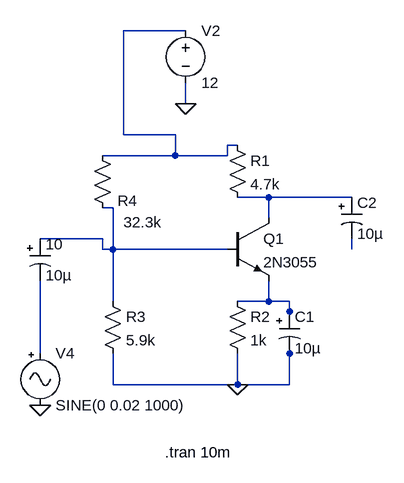
[diagram p0: schematic exp3(single stage amplifier using 3055A.asc]
exp3(single stage amplifier using 3055A.asc, the LTspice schematic file:
Version 4
SHEET 1 1288 680
WIRE 304 -128 208 -128
WIRE 304 -16 304 -48
WIRE 208 32 208 -128
WIRE 288 32 208 32
WIRE 384 48 368 48
WIRE 288 64 288 32
WIRE 288 64 176 64
WIRE 368 64 368 48
WIRE 368 64 288 64
WIRE 432 128 384 128
WIRE 560 128 432 128
WIRE 192 144 176 144
WIRE 432 160 432 128
WIRE 176 192 80 192
WIRE 176 208 176 192
WIRE 192 208 192 144
WIRE 192 208 176 208
WIRE 368 208 192 208
WIRE 560 208 560 192
WIRE 192 288 192 208
WIRE 432 288 432 256
WIRE 432 288 384 288
WIRE 464 288 432 288
WIRE 464 304 464 288
WIRE 464 320 464 304
WIRE 80 368 80 256
WIRE 464 368 464 352
WIRE 192 416 192 368
WIRE 384 416 384 368
WIRE 384 416 192 416
WIRE 464 416 464 368
WIRE 464 416 384 416
FLAG 384 416 0
FLAG 304 -16 0
FLAG 80 448 0
SYMBOL npn 368 160 R0
SYMATTR InstName Q1
SYMATTR Value 2N3055
SYMBOL res 368 32 R0
SYMATTR InstName R1
SYMATTR Value 4.7k
SYMBOL res 368 272 R0
SYMATTR InstName R2
SYMATTR Value 1k
SYMBOL res 176 272 R0
SYMATTR InstName R3
SYMATTR Value 5.9k
SYMBOL res 160 48 R0
WINDOW 0 39 85 Left 2
WINDOW 3 48 118 Left 2
SYMATTR InstName R4
SYMATTR Value 32.3k
SYMBOL polcap 448 304 R0
WINDOW 3 24 56 Left 2
SYMATTR Value 10µ
SYMATTR InstName C1
SYMATTR SpiceLine Rser=4 Lser=0 mfg="AVX" pn="TAJA106M006" type="Tantalum"
SYMATTR Description Capacitor
SYMATTR Type cap
SYMBOL polcap 64 192 R0
WINDOW 3 24 56 Left 2
SYMATTR Value 10µ
SYMATTR InstName 10
SYMATTR Description Capacitor
SYMATTR Type cap
SYMATTR SpiceLine Rser=4 Lser=0 mfg="AVX" pn="TAJA106M006" type="Tantalum"
SYMBOL voltage 304 -144 R0
SYMATTR InstName V2
SYMATTR Value 12
SYMBOL Misc/signal 80 352 R0
SYMATTR InstName V4
SYMATTR Value SINE(0 0.02 1000)
SYMATTR Value2 AC 0.02 0
SYMBOL polcap 544 128 R0
WINDOW 3 24 56 Left 2
SYMATTR Value 10µ
SYMATTR InstName C2
SYMATTR Description Capacitor
SYMATTR Type cap
SYMATTR SpiceLine Rser=4 Lser=0 mfg="AVX" pn="TAJA106M006" type="Tantalum"
TEXT 272 520 Left 2 !.tran 10m

The netlist it stands for:
* exp3(single stage amplifier using 3055A.asc
Q1 N002 N003 N005 0 2N3055
R1 N001 N002 4.7k
R2 N005 0 1k
R3 N003 0 5.9k
R4 N001 N003 32.3k
C1 N005 0 10µ Rser=4 Lser=0 mfg="AVX" pn="TAJA106M006" type="Tantalum"
C§10 N003 N006 10µ Rser=4 Lser=0 mfg="AVX" pn="TAJA106M006" type="Tantalum"
V2 N001 0 12
V4 N006 0 SINE(0 0.02 1000) AC 0.02 0
C2 N002 N004 10µ Rser=4 Lser=0 mfg="AVX" pn="TAJA106M006" type="Tantalum"
.model NPN NPN
.model PNP PNP
.lib standard.bjt
.tran 10m
.backanno
.end